# Altium schematic sheet ys18-3 for yi.schdoc
size 571 x 444 mm; Symbol: Sheet-Symbol_C; Device: Sheet-Symbol_C; @Page Name: P1; @Create Date: 2022-10-18; @Page Count: 1; @Page No: 1; @Project Name: ys18-3 for yi; @Schematic Name: Schematic1; @Update Date: 2022-10-27; Company: 嘉立创EDA; Page Size: C; Version: V1.0
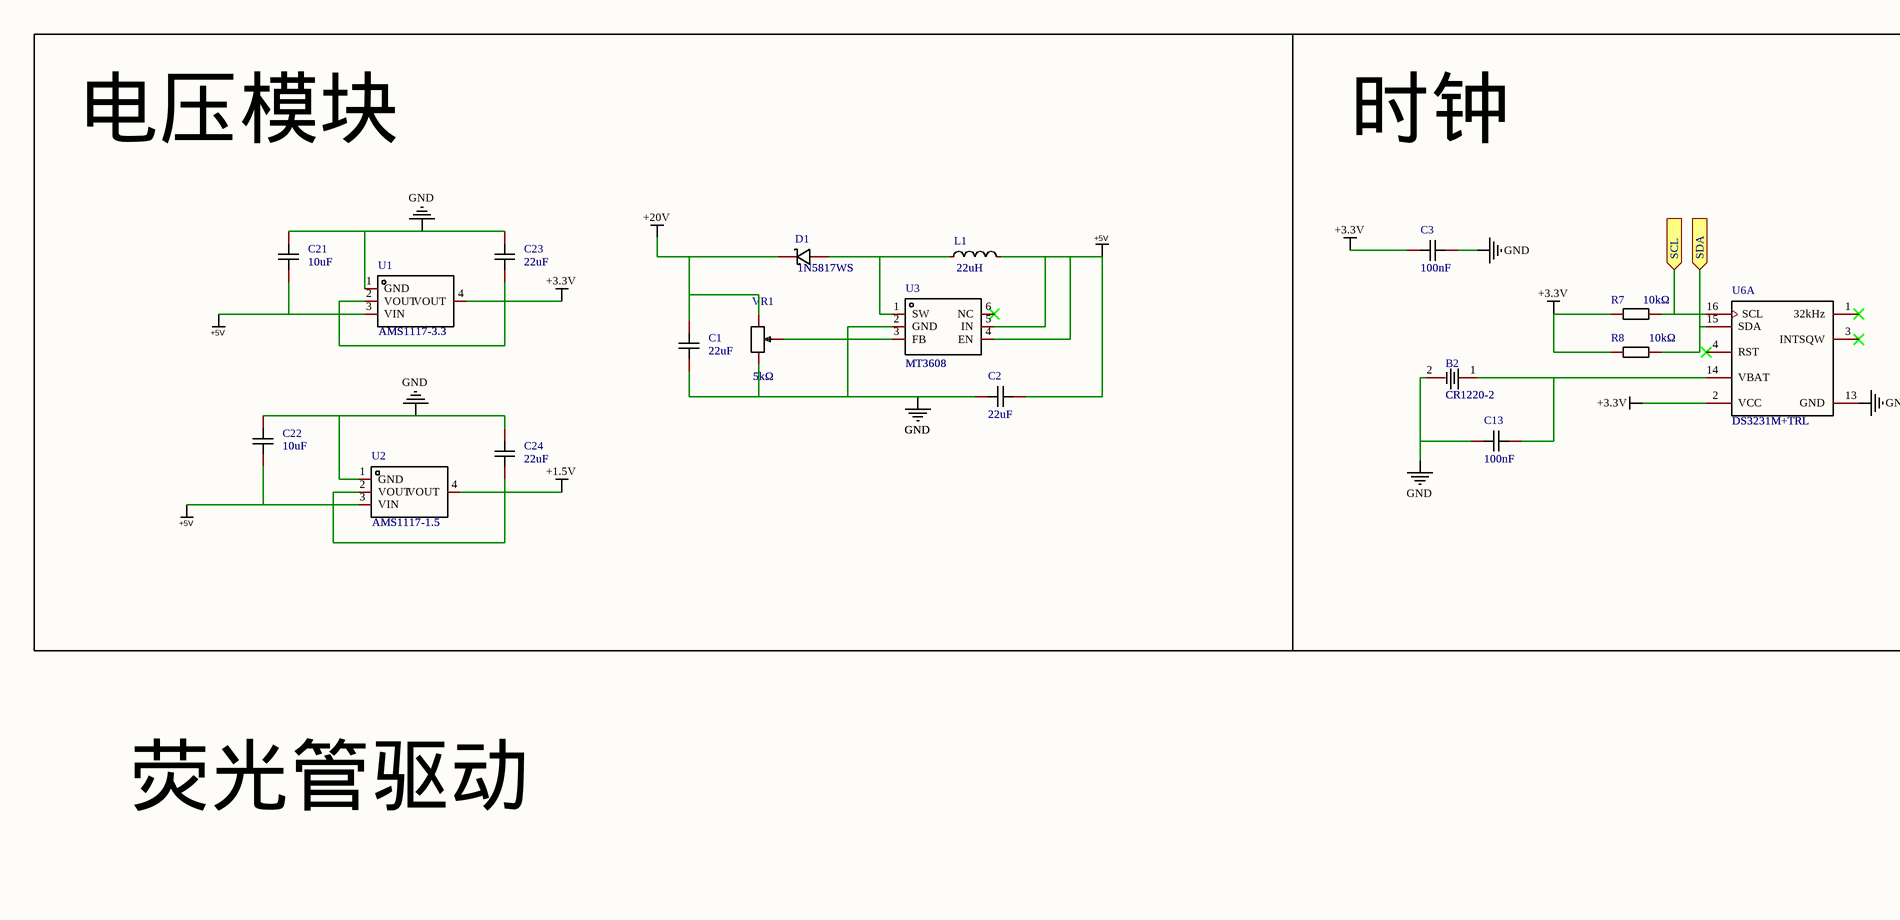
[diagram p0: ys18-3 for yi.schdoc, top left]
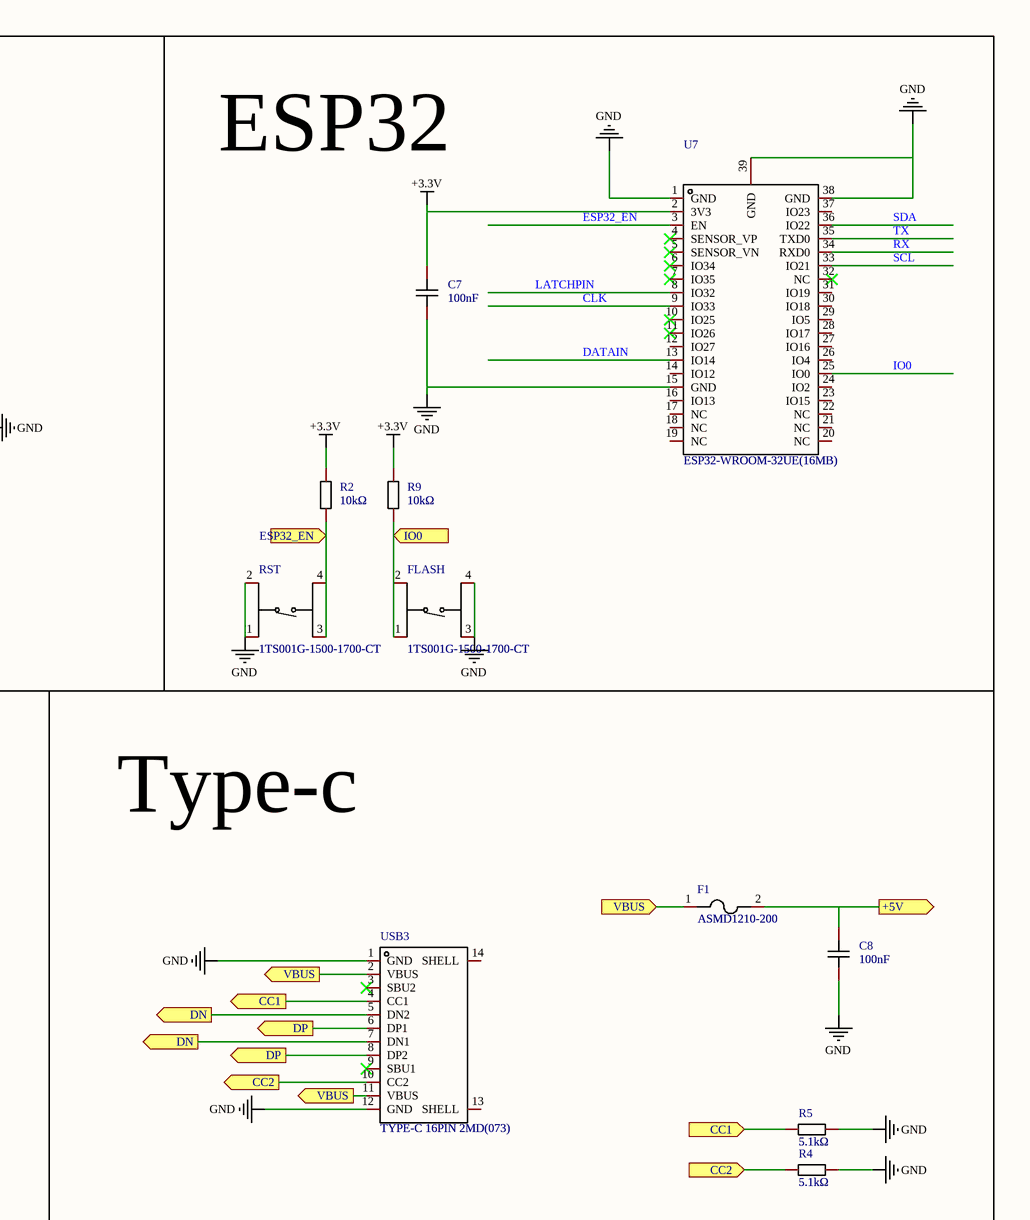
[diagram p1: ys18-3 for yi.schdoc, top right]
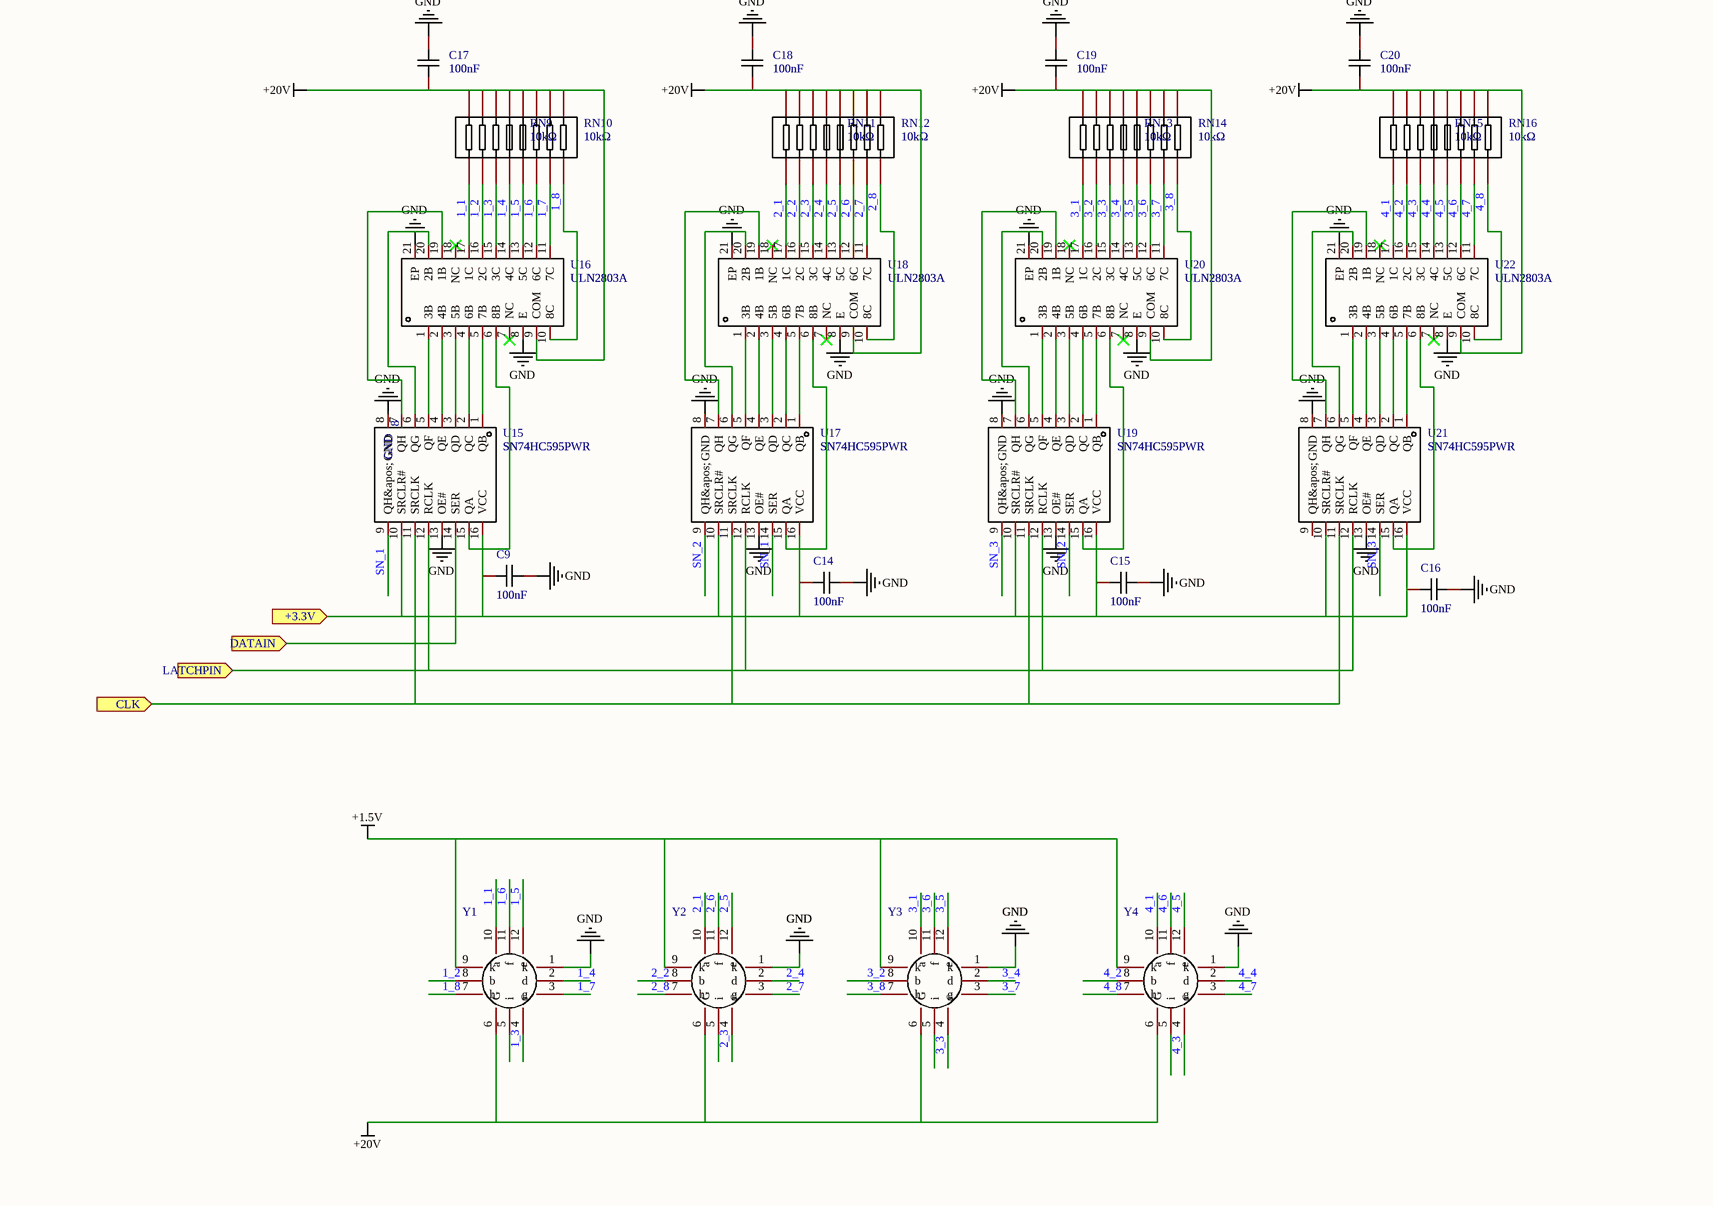
[diagram p2: ys18-3 for yi.schdoc, bottom left]
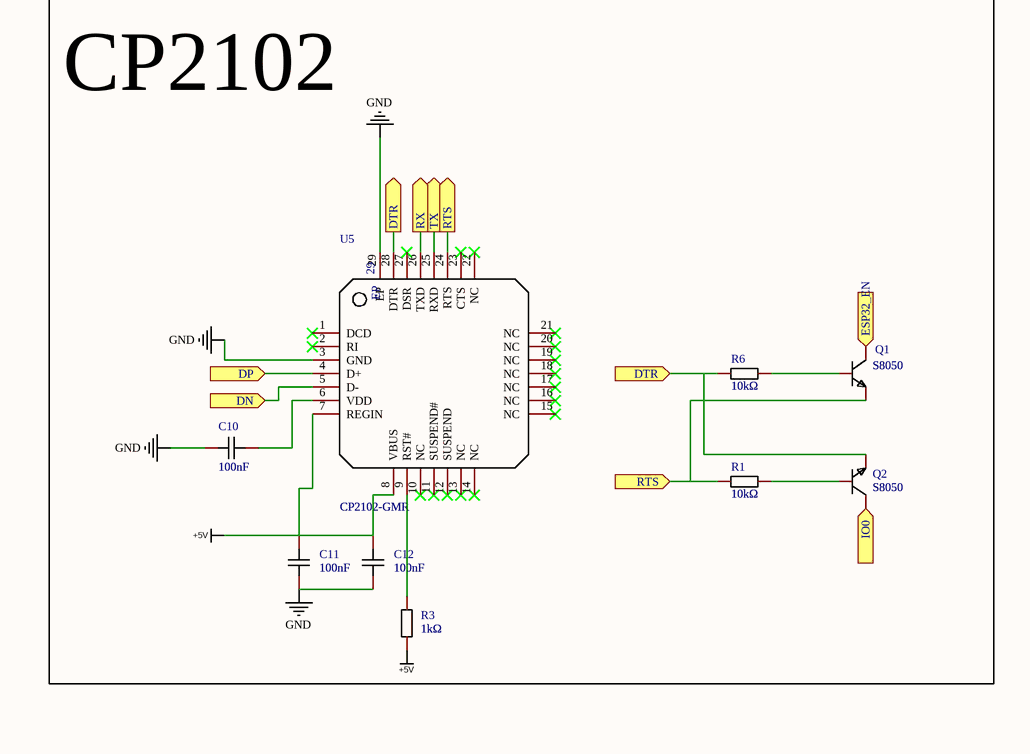
[diagram p3: ys18-3 for yi.schdoc, bottom right]

## Parts
B2  CR1220-2  [BAT-SMD_CR1220-2]
C1  22uF  [C0603]
C2  22uF  [C0603]
C3  100nF  [C0603]
C7  100nF  [C0603]
C8  100nF  [C0603]
C9  100nF  [C0603]
C10  100nF  [C0603]
C11  100nF  [C0603]
C12  100nF  [C0603]
C13  100nF  [C0603]
C14  100nF  [C0603]
C15  100nF  [C0603]
C16  100nF  [C0603]
C17  100nF  [C0603]
C18  100nF  [C0603]
C19  100nF  [C0603]
C20  100nF  [C0603]
C21  10uF  [C0603]
C22  10uF  [C0603]
C23  22uF  [C0603]
C24  22uF  [C0603]
D1  1N5817WS  [SOD-323_L1.8-W1.3-LS2.5-RD]
F1  ASMD1210-200  [F1210]
FLASH  1TS001G-1500-1700-CT  [SW-SMD_4P-L5.1-W5.1-P3.70-LS6.5-TL-2]
L1  22uH  [L1206]
Q1  S8050  [SOT-23_L2.9-W1.3-P1.90-LS2.4-BR]
Q2  S8050  [SOT-23_L2.9-W1.3-P1.90-LS2.4-BR]
R1  10kΩ  [R0603]
R2  10kΩ  [R0603]
R3  1kΩ  [R0603]
R4  5.1kΩ  [R0603]
R5  5.1kΩ  [R0603]
R6  10kΩ  [R0603]
R7  10kΩ  [R0603]
R8  10kΩ  [R0603]
R9  10kΩ  [R0603]
RN9  10kΩ  [RES-ARRAY-SMD_0603-8P-L3.2-W1.6-BL]
RN10  10kΩ  [RES-ARRAY-SMD_0603-8P-L3.2-W1.6-BL]
RN11  10kΩ  [RES-ARRAY-SMD_0603-8P-L3.2-W1.6-BL]
RN12  10kΩ  [RES-ARRAY-SMD_0603-8P-L3.2-W1.6-BL]
RN13  10kΩ  [RES-ARRAY-SMD_0603-8P-L3.2-W1.6-BL]
RN14  10kΩ  [RES-ARRAY-SMD_0603-8P-L3.2-W1.6-BL]
RN15  10kΩ  [RES-ARRAY-SMD_0603-8P-L3.2-W1.6-BL]
RN16  10kΩ  [RES-ARRAY-SMD_0603-8P-L3.2-W1.6-BL]
RST  1TS001G-1500-1700-CT  [SW-SMD_4P-L5.1-W5.1-P3.70-LS6.5-TL-2]
U1  AMS1117-3.3  [SOT-223-3_L6.7-W3.7-P2.30-LS7.0-BR]
U2  AMS1117-1.5  [SOT-223_L6.3-W3.5-P2.30-LS7.0-BR]
U3  MT3608  [SOT-23-6_L2.9-W1.6-P0.95-LS2.8-BR]
U5  CP2102-GMR  NAME: EP  NUMBER: 29  [WQFN-28_L5.0-W5.0-P0.50-BL-EP3.2]
U6  DS3231M+TRL  [SOIC-16_L10.3-W7.5-P1.27-LS10.3-BL]  (part A of 2)
U7  ESP32-WROOM-32UE(16MB)  [WIFI-SMD_ESP32-WROOM-32UE]
U15  SN74HC595PWR  NAME: GND  NUMBER: 8  [TSSOP-16_L5.0-W4.4-P0.65-LS6.4-BL]
U16  ULN2803A  [QFN-20_L4.0-W4.0-P0.50-BL-EP]
U17  SN74HC595PWR  [TSSOP-16_L5.0-W4.4-P0.65-LS6.4-BL]
U18  ULN2803A  [QFN-20_L4.0-W4.0-P0.50-BL-EP]
U19  SN74HC595PWR  [TSSOP-16_L5.0-W4.4-P0.65-LS6.4-BL]
U20  ULN2803A  [QFN-20_L4.0-W4.0-P0.50-BL-EP]
U21  SN74HC595PWR  [TSSOP-16_L5.0-W4.4-P0.65-LS6.4-BL]
U22  ULN2803A  [QFN-20_L4.0-W4.0-P0.50-BL-EP]
USB3  TYPE-C 16PIN 2MD(073)  [USB-C-SMD_TYPE-C-6PIN-2MD-073]
VR1  5kΩ  [RES-ADJ-SMD_3224W]
Y1  ys18-3  (value not drawn)
Y2  ys18-3  (value not drawn)
Y3  ys18-3  (value not drawn)
Y4  ys18-3  (value not drawn)

## Blocks framed on the sheet
电压模块: C1 C2 C21-C24 D1 L1 U1-U3 VR1
时钟: B2 C3 C13 R7 R8 U6
ESP32: C7 FLASH R2 R9 RST U7

## Ports
+3.3V (in), +5V (out), CC1 (in), CC1 (out), CC2 (in), CC2 (out), CLK (in), DATAIN (in), DN (in), DN (out), DP (in), DP (out), DTR (in), DTR (out), ESP32_EN (in), IO0 (in), LATCHPIN (in), RTS (in), RTS (out), RX (out), SCL (in), SDA (in), TX (out), VBUS (in), VBUS (out)

## Nets
+1.5V: C24.1 U2.2(VOUT) U2.4(VOUT) Y1.9(k) Y2.9(k) Y3.9(k) Y4.9(k)
+3.3V: C3.1 C7.1 C23.1 R2.1 R7.2 R8.1 R9.1 U1.2(VOUT) U1.4(VOUT) U6.2(VCC) U7.2(3V3)
+5V: C2.1 C11.1 C12.1 C21.1 C22.1 L1.2 R3.1 U1.3(VIN) U2.3(VIN) U3.4(EN) U3.5(IN) U5.7(REGIN) U5.8(VBUS)
+20V: C1.2 C17.1 C18.1 C19.1 C20.1 D1.1 RN9.5 RN9.6 RN9.7 RN9.8 RN10.5 RN10.6 RN10.7 RN10.8 RN11.5 RN11.6 RN11.7 RN11.8 RN12.5 RN12.6 RN12.7 RN12.8 RN13.5 RN13.6 RN13.7 RN13.8 RN14.5 RN14.6 RN14.7 RN14.8 RN15.5 RN15.6 RN15.7 RN15.8 RN16.5 RN16.6 RN16.7 RN16.8 U16.9(COM) U18.9(COM) U20.9(COM) U22.9(COM) VR1.3 Y1.6(G) Y2.6(G) Y3.6(G) Y4.6(G)
GND: B2.2 C1.1 C2.2 C3.2 C7.2 C8.2 C9.2 C10.1 C11.2 C12.2 C13.1 C14.2 C15.2 C16.2 C17.2 C18.2 C19.2 C20.2 C21.2 C22.2 C23.2 C24.2 FLASH.3(C) FLASH.4(D) R4.2 R5.2 RST.1(A) RST.2(B) U1.1(GND) U2.1(GND) U3.2(GND) U5.3(GND) U5.29(EP) U6.13(GND) U7.1(GND) U7.15(GND) U7.38(GND) U7.39(GND) U15.8(GND) U15.13(OE#) U16.8(E) U16.21(EP) U17.8(GND) U17.13(OE#) U18.8(E) U18.21(EP) U19.8(GND) U19.13(OE#) U20.8(E) U20.21(EP) U21.8(GND) U21.13(OE#) U22.8(E) U22.21(EP) USB3.1(GND) USB3.12(GND) VR1.1 Y1.1(k) Y2.1(k) Y3.1(k) Y4.1(k)
1_1: RN9.1 U16.17(1C) Y1.10(a)
1_2: RN9.2 U16.16(2C) Y1.8(b)
1_3: RN9.3 U16.15(3C) Y1.4(c)
1_4: RN9.4 U16.14(4C) Y1.2(d)
1_5: RN10.1 U16.13(5C) Y1.12(e)
1_6: RN10.2 U16.12(6C) Y1.11(f)
1_7: RN10.3 U16.11(7C) Y1.3(g)
1_8: RN10.4 U16.10(8C) Y1.7(h)
2_1: RN11.1 U18.17(1C) Y2.10(a)
2_2: RN11.2 U18.16(2C) Y2.8(b)
2_3: RN11.3 U18.15(3C) Y2.4(c)
2_4: RN11.4 U18.14(4C) Y2.2(d)
2_5: RN12.1 U18.13(5C) Y2.12(e)
2_6: RN12.2 U18.12(6C) Y2.11(f)
2_7: RN12.3 U18.11(7C) Y2.3(g)
2_8: RN12.4 U18.10(8C) Y2.7(h)
3_1: RN13.1 U20.17(1C) Y3.10(a)
3_2: RN13.2 U20.16(2C) Y3.8(b)
3_3: RN13.3 U20.15(3C) Y3.4(c)
3_4: RN13.4 U20.14(4C) Y3.2(d)
3_5: RN14.1 U20.13(5C) Y3.12(e)
3_6: RN14.2 U20.12(6C) Y3.11(f)
3_7: RN14.3 U20.11(7C) Y3.3(g)
3_8: RN14.4 U20.10(8C) Y3.7(h)
4_1: RN15.1 U22.17(1C) Y4.10(a)
4_2: RN15.2 U22.16(2C) Y4.8(b)
4_3: RN15.3 U22.15(3C) Y4.4(c)
4_4: RN15.4 U22.14(4C) Y4.2(d)
4_5: RN16.1 U22.13(5C) Y4.12(e)
4_6: RN16.2 U22.12(6C) Y4.11(f)
4_7: RN16.3 U22.11(7C) Y4.3(g)
4_8: RN16.4 U22.10(8C) Y4.7(h)
+3.3V: C9.1 C14.1 C15.1 C16.1 U15.10(SRCLR#) U15.16(VCC) U17.10(SRCLR#) U17.16(VCC) U19.10(SRCLR#) U19.16(VCC) U21.10(SRCLR#) U21.16(VCC) ; port +3.3V  [a separate net that carries the same name]
+5V: C8.1 F1.2 ; port +5V  [a separate net that carries the same name]
CC1: R5.1 USB3.4(CC1) ; port CC1
CC2: R4.1 USB3.10(CC2) ; port CC2
CLK: U7.9(IO33)
CLK: U15.11(SRCLK) U17.11(SRCLK) U19.11(SRCLK) U21.11(SRCLK) ; port CLK  [a separate net that carries the same name]
DATAIN: U7.13(IO14)
DATAIN: U15.14(SER) ; port DATAIN  [a separate net that carries the same name]
DN: U5.5(D-) USB3.5(DN2) USB3.7(DN1) ; port DN
DP: U5.4(D+) USB3.6(DP1) USB3.8(DP2) ; port DP
DTR: Q2.2(E) R6.2 U5.28(DTR) ; port DTR
ESP32_EN: Q1.3(C) R2.2 RST.3(C) RST.4(D) ; port ESP32_EN
ESP32_EN: U7.3(EN)  [a separate net that carries the same name]
IO0: FLASH.1(A) FLASH.2(B) Q2.3(C) R9.2 ; port IO0
IO0: U7.25(IO0)  [a separate net that carries the same name]
LATCHPIN: U7.8(IO32)
LATCHPIN: U15.12(RCLK) U17.12(RCLK) U19.12(RCLK) U21.12(RCLK) ; port LATCHPIN  [a separate net that carries the same name]
RTS: Q1.2(E) R1.2 U5.24(RTS) ; port RTS
RX: U5.26(TXD) ; port RX
RX: U7.34(RXD0)  [a separate net that carries the same name]
SCL: R7.1 U6.16(SCL) ; port SCL
SCL: U7.33(IO21)  [a separate net that carries the same name]
SDA: R8.2 U6.15(SDA) ; port SDA
SDA: U7.36(IO22)  [a separate net that carries the same name]
SN_1: U15.9(QH&apos;) U17.14(SER)
SN_2: U17.9(QH&apos;) U19.14(SER)
SN_3: U19.9(QH&apos;) U21.14(SER)
TX: U5.25(RXD) ; port TX
TX: U7.35(TXD0)  [a separate net that carries the same name]
VBUS: F1.1 USB3.2(VBUS) USB3.11(VBUS) ; port VBUS
NetB2_1: B2.1 C13.2 U6.14(VBAT)
NetC10_2: C10.2 U5.6(VDD)
NetD1_2: D1.2 L1.1 U3.1(SW)
NetQ1_1: Q1.1(B) R6.1
NetQ2_1: Q2.1(B) R1.1
NetR3_2: R3.2 U5.9(RST#)
NetU3_3: U3.3(FB) VR1.2
NetU15_1: U15.1(QB) U16.5(7B)
NetU15_2: U15.2(QC) U16.4(6B)
NetU15_3: U15.3(QD) U16.3(5B)
NetU15_4: U15.4(QE) U16.2(4B)
NetU15_5: U15.5(QF) U16.1(3B)
NetU15_6: U15.6(QG) U16.20(2B)
NetU15_7: U15.7(QH) U16.19(1B)
NetU15_15: U15.15(QA) U16.6(8B)
NetU17_1: U17.1(QB) U18.5(7B)
NetU17_2: U17.2(QC) U18.4(6B)
NetU17_3: U17.3(QD) U18.3(5B)
NetU17_4: U17.4(QE) U18.2(4B)
NetU17_5: U17.5(QF) U18.1(3B)
NetU17_6: U17.6(QG) U18.20(2B)
NetU17_7: U17.7(QH) U18.19(1B)
NetU17_15: U17.15(QA) U18.6(8B)
NetU19_1: U19.1(QB) U20.5(7B)
NetU19_2: U19.2(QC) U20.4(6B)
NetU19_3: U19.3(QD) U20.3(5B)
NetU19_4: U19.4(QE) U20.2(4B)
NetU19_5: U19.5(QF) U20.1(3B)
NetU19_6: U19.6(QG) U20.20(2B)
NetU19_7: U19.7(QH) U20.19(1B)
NetU19_15: U19.15(QA) U20.6(8B)
NetU21_1: U21.1(QB) U22.5(7B)
NetU21_2: U21.2(QC) U22.4(6B)
NetU21_3: U21.3(QD) U22.3(5B)
NetU21_4: U21.4(QE) U22.2(4B)
NetU21_5: U21.5(QF) U22.1(3B)
NetU21_6: U21.6(QG) U22.20(2B)
NetU21_7: U21.7(QH) U22.19(1B)
NetU21_15: U21.15(QA) U22.6(8B)

Not connected (* = marked no-connect by the designer): U3 6(NC)*; U5 1(DCD)* 2(RI)* 10(NC)* 11(SUSPEND#)* 12(SUSPEND)* 13(NC)* 14(NC)* 15(NC)* 16(NC)* 17(NC)* 18(NC)* 19(NC)* 20(NC)* 21(NC)* 22(NC)* 23(CTS)* 27(DSR)*; U6 1(32kHz)* 3(INTSQW)* 4(RST)*; U7 4(SENSOR_VP)* 5(SENSOR_VN)* 6(IO34)* 7(IO35)* 10(IO25)* 11(IO26)* 12(IO27) 14(IO12) 16(IO13) 17(NC) 18(NC) 19(NC) 20(NC) 21(NC) 22(NC) 23(IO15) 24(IO2) 26(IO4) 27(IO16) 28(IO17) 29(IO5) 30(IO18) 31(IO19) 32(NC)* 37(IO23); U16 7(NC)* 18(NC)*; U18 7(NC)* 18(NC)*; U20 7(NC)* 18(NC)*; U21 9(QH&apos;); U22 7(NC)* 18(NC)*; USB3 3(SBU2)* 9(SBU1)* 13(SHELL) 14(SHELL); Y1 5(i); Y2 5(i); Y3 5(i); Y4 5(i)

## Notes on the sheet
- Type-c
- 荧光管驱动
- CP2102
- 1
- 2
- 3
- 4
- 5
- 6
- A
- B
- C
- D
- Schematic
- Schematic1
- Create Date
- Update Date
- 2022-10-18
- 2022-10-27
- Reviewed
- Drawed
- Page
- P1
- Part Number
- ys18-3 for yi
- VER
- SIZE
- PAGE
- OF
- V1.0
- 嘉立创EDA

## Library data of the parts
B2 = CR1220-2: 连接器类型:电池底座;适用电池规格:CR1220;工作温度范围:-;; Manufacturer: Q&J; Add into BOM: yes; Connector Type: 电池底座; Battery Type: CR1220; Name: CR1220-2; Symbol: CR1220-2; Device: CR1220-2; LCSC Part Name: 电池底座 适用电池:CR1220; Supplier Part: C70381; Manufacturer Part: CR1220-2; Supplier Footprint: SMD; JLCPCB Part Class: Extended Part; Datasheet: https://atta.szlcsc.com/upload/public/pdf/source/20160427/1461725216696.pdf; Supplier: LCSC; Convert to PCB: yes; Operating Temperature Range: -
C1 C2 C23 C24 = CL10A226MP8NUNE: 温度系数:X5R;精度:±20%;额定电压:10V;容值:22uF;; Manufacturer: SAMSUNG(三星); Add into BOM: yes; Temperature Coefficient: X5R; Tolerance: ±20%; Voltage Rated: 10V; Name: 22uF; Symbol: CL10A226MP8NUNE; Device: CL10A226MP8NUNE; LCSC Part Name: 22uF(226) ±20% 10V; Supplier Part: C86295; Manufacturer Part: CL10A226MP8NUNE; Supplier Footprint: 0603; JLCPCB Part Class: Extended Part; Datasheet: https://atta.szlcsc.com/upload/public/pdf/source/20170325/1490427882169.pdf; Supplier: LCSC; Convert to PCB: yes; Value: 22uF
C3 C7 C9 C13-C20 = CC0603KRX7R9BB104: 容值:100nF;精度:±10%;额定电压:50V;材质(温度系数):X7R;; Manufacturer: YAGEO(国巨); Add into BOM: yes; Tolerance: ±10%; Voltage Rated: 50V; Temperature Coefficient: X7R; Name: 100nF; Symbol: CC0603KRX7R9BB104; Device: CC0603KRX7R9BB104; LCSC Part Name: 100nF ±10% 50V; Supplier Part: C14663; Manufacturer Part: CC0603KRX7R9BB104; Supplier Footprint: 0603; JLCPCB Part Class: Basic Part; Datasheet: https://atta.szlcsc.com/upload/public/pdf/source/20170116/1484561234239.pdf; Supplier: LCSC; Convert to PCB: yes; Value: 100nF
C8 C10-C12 = CL10B104KB8NNNC: 容值:100nF;精度:±10%;额定电压:50V;材质(温度系数):X7R;; Manufacturer: SAMSUNG(三星); Add into BOM: yes; Tolerance: ±10%; Voltage Rated: 50V; Temperature Coefficient: X7R; Name: 100nF; Symbol: CL10B104KB8NNNC; Device: CL10B104KB8NNNC; LCSC Part Name: 100nF ±10% 50V; Supplier Part: C1591; Manufacturer Part: CL10B104KB8NNNC; Supplier Footprint: 0603; JLCPCB Part Class: Extended Part; Datasheet: https://atta.szlcsc.com/upload/public/pdf/source/20160103/1457707680512.pdf; Supplier: LCSC; Convert to PCB: yes; Value: 100nF
C21 C22 = CL10A106KP8NNNC: 容值:10uF;精度:±10%;额定电压:10V;材质(温度系数):X5R;; Manufacturer: SAMSUNG(三星); Add into BOM: yes; Tolerance: ±10%; Voltage Rated: 10V; Temperature Coefficient: X5R; Name: 10uF; Symbol: CL10A106KP8NNNC; Device: CL10A106KP8NNNC; LCSC Part Name: 10uF ±10% 10V; Supplier Part: C19702; Manufacturer Part: CL10A106KP8NNNC; Supplier Footprint: 0603; JLCPCB Part Class: Basic Part; Datasheet: https://atta.szlcsc.com/upload/public/pdf/source/20160103/1457707703378.pdf; Supplier: LCSC; Convert to PCB: yes; Value: 10uF
D1 = 1N5817WS: 直流反向耐压(Vr):20V;平均整流电流(Io):1A;正向压降(Vf):750mV@3.1A;; Manufacturer: KEXIN(科信); Add into BOM: yes; Reverse Voltage (Vr): 20V; Average Rectified Current (Io): 1A; Name: 1N5817WS; Symbol: 1N5817WS; Device: 1N5817WS; LCSC Part Name: 20V 1A 750mV@3.1A; Supplier Part: C489146; Manufacturer Part: 1N5817WS; Supplier Footprint: SOD-323; JLCPCB Part Class: Extended Part; Datasheet: https://atta.szlcsc.com/upload/public/pdf/source/20200225/C489146_1AEA3DEFB6CB7B45A04303A9837E7FE9.pdf; Supplier: LCSC; Convert to PCB: yes; Forward Voltage (Vf@If): 750mV@3.1A
F1 = ASMD1210-200: 最大电压:6V;最大电流:100A;保持电流:2A;跳闸电流:4A;消耗功率:800mW;初始态阻值(最小值):15mΩ;跳断后阻值(最大值):70mΩ;最大动作时间:1s;工作温度:-40~+85;; Manufacturer: JDTfuse(集电通); Add into BOM: yes; Operating Voltage (Max): 6V; Current Rating (Max): 100A; Hold Current: 2A; Trip Current: 4A; Power Dissipation: 800mW; Resistance - Initial (Ri) (Min): 15mΩ; Resistance - Post Trip (R1) (Max): 70mΩ; Maximum Time to Trip: 1s; Name: ASMD1210-200; Symbol: ASMD1210-200; Device: ASMD1210-200; LCSC Part Name: 2A 自恢复; Supplier Part: C135353; Manufacturer Part: ASMD1210-200; Supplier Footprint: 1210; JLCPCB Part Class: Extended Part; Datasheet: https://atta.szlcsc.com/upload/public/pdf/source/20220401/E691521C3F91CC1DEA097B44A52FED26.pdf; Supplier: LCSC; Convert to PCB: yes; Operating Temperature: -40~+85
FLASH RST = 1TS001G-1500-1700-CT: 触点电流:20mA;额定电压(DC):12V;电路结构:单刀单掷;安装方式:立贴;按钮形状:圆形按钮;带灯:-;开关长度:5.1mm;开关宽度:5.1mm;开关高度:0.5mm;; Manufacturer: HYP(鸿源精密); Add into BOM: yes; Contact Current: 20mA; Voltage Rating (DC): 12V; Circuit: 单刀单掷; Actuator Style: 圆形按钮; Switch Length: 5.1mm; Switch Height: 0.5mm; Name: 1TS001G-1500-1700-CT; Symbol: 1TS001G-1500-1700; Device: 1TS001G-1500-1700-CT; LCSC Part Name: 铜头按钮; Supplier Part: C318801; Manufacturer Part: 1TS001G-1500-1700-CT; Supplier Footprint: SMD,5.1x5.1mm; JLCPCB Part Class: Extended Part; Datasheet: https://atta.szlcsc.com/upload/public/pdf/source/20200109/C318801_99D5DB96CF1592C478CEC78FA29D92FA.pdf; Supplier: LCSC; Convert to PCB: yes; Mounting Style: 立贴; With Lamp: -; Switch Width: 5.1mm
L1 = CMP321609JE220MT: 电感值:22uH;精度:±20%;额定电流:50mA;饱和电流(Isat):-;直流电阻(DCR):1Ω;; Manufacturer: FH(风华); Add into BOM: yes; Tolerance: ±20%; Rated Current: 50mA; DC Resistance (DCR): 1Ω; Frequency - Self Resonant: 16MHz; Name: 22uH; Symbol: CMP321609JE220MT; Device: CMP321609JE220MT; LCSC Part Name: 22uH ±20% 50mA 1Ω; Supplier Part: C395020; Manufacturer Part: CMP321609JE220MT; Supplier Footprint: 1206; JLCPCB Part Class: Extended Part; Datasheet: https://atta.szlcsc.com/upload/public/pdf/source/20190710/C395020_13B0BAAF995C388AF2EAC40278D9911F.pdf; Supplier: LCSC; Convert to PCB: yes; Value: 22uH; Saturation Current (Isat): -; Q @ Freq: -; Ratings: -
Q1 Q2 = S8050: 晶体管类型:NPN;集射极击穿电压(Vceo):25V;集电极电流(Ic):500mA;功率(Pd):625mW;集电极-发射极饱和电压(VCE(sat)@Ic,Ib):600mV@500mA,50mA;直流电流增益(hFE@Ic,Vce):200@100mA,1V;特征频率(fT):150MHz;工作温度:+150@(Tj);; Manufacturer: GP(格瑞宝); Symbol: S8050_C414195; Add into BOM: yes; Transistor Type: NPN; Collector-Emitter Breakdown Voltage (Vceo): 25V; Collector Current (Ic): 500mA; Power Dissipation (Pd): 625mW; Transition Frequency (fT): 150MHz; Name: S8050; Device: S8050; LCSC Part Name: NPN 25V 500mA; Supplier Part: C414195; Manufacturer Part: S8050; Supplier Footprint: SOT-23; JLCPCB Part Class: Extended Part; Datasheet: https://atta.szlcsc.com/upload/public/pdf/source/20190828/C414195_F420B1E456405127F3181AB0586AEC6F.pdf; Supplier: LCSC; Convert to PCB: yes; Collector-Emitter Saturation Voltage (VCE(sat)@Ic,Ib): 600mV@500mA,50mA; DC Current Gain (hFE@Ic,Vce): 200@100mA,1V; Operating Temperature: +150@(Tj)
R1 R2 R6-R9 = 0603WAF1002T5E: 电阻类型:厚膜电阻;阻值:10kΩ;精度:±1%;功率:100mW;温度系数:±100ppm/;最大工作电压:75V;工作温度范围:-55~+155;; Manufacturer: UNI-ROYAL(厚声); Add into BOM: yes; Tolerance: ±1%; Power(Watts): 100mW; Overload Voltage (Max): 75V; Name: 10kΩ; Symbol: 0603WAF1002T5E; Device: 0603WAF1002T5E; LCSC Part Name: 10kΩ ±1% 100mW; Supplier Part: C25804; Manufacturer Part: 0603WAF1002T5E; Supplier Footprint: 0603; JLCPCB Part Class: Basic Part; Datasheet: https://atta.szlcsc.com/upload/public/pdf/source/20200306/C422600_1E6D84923E4A46A82E41ADD87F860B5C.pdf; Supplier: LCSC; Convert to PCB: yes; Type: 厚膜电阻; Value: 10kΩ; Temperature Coefficient: ±100ppm/; Operating Temperature Range: -55~+155
R3 = RC0603FR-071KL: 电阻类型:厚膜电阻;阻值:1kΩ;精度:±1%;功率:100mW;温度系数:±100ppm/;最大工作电压:75V;工作温度范围:-55~+155;; Manufacturer: YAGEO(国巨); Add into BOM: yes; Tolerance: ±1%; Power(Watts): 100mW; Overload Voltage (Max): 75V; Name: 1kΩ; Symbol: RC0603FR-071KL; Device: RC0603FR-071KL; LCSC Part Name: 1kΩ ±1% 100mW; Supplier Part: C22548; Manufacturer Part: RC0603FR-071KL; Supplier Footprint: 0603; JLCPCB Part Class: Extended Part; Datasheet: https://atta.szlcsc.com/upload/public/pdf/source/20180312/7BD3618A8B6324EA6280B0497A051AB7.pdf; Supplier: LCSC; Convert to PCB: yes; Type: 厚膜电阻; Value: 1kΩ; Temperature Coefficient: ±100ppm/; Operating Temperature Range: -55~+155
R4 R5 = 0603WAF5101T5E: 电阻类型:厚膜电阻;阻值:5.1kΩ;精度:±1%;功率:100mW;温度系数:±100ppm/;最大工作电压:75V;工作温度范围:-55~+155;; Manufacturer: UNI-ROYAL(厚声); Add into BOM: yes; Tolerance: ±1%; Power(Watts): 100mW; Overload Voltage (Max): 75V; Name: 5.1kΩ; Symbol: 0603WAF5101T5E; Device: 0603WAF5101T5E; LCSC Part Name: 5.1kΩ ±1% 100mW; Supplier Part: C23186; Manufacturer Part: 0603WAF5101T5E; Supplier Footprint: 0603; JLCPCB Part Class: Basic Part; Datasheet: https://atta.szlcsc.com/upload/public/pdf/source/20200306/C422600_1E6D84923E4A46A82E41ADD87F860B5C.pdf; Supplier: LCSC; Convert to PCB: yes; Type: 厚膜电阻; Value: 5.1kΩ; Temperature Coefficient: ±100ppm/; Operating Temperature Range: -55~+155
RN9-RN16 = 4D03WGJ0103T5E: 阻值:10kΩ;单个元件功率:62.5mW;电阻器数:4;引脚数:8;; Manufacturer: UNI-ROYAL(厚声); Add into BOM: yes; Power(Watts): 62.5mW; Number of Resistors: 4; Name: 10kΩ; Symbol: 4D03WGJ0103T5E; Device: 4D03WGJ0103T5E; LCSC Part Name: 10kΩ ±5%; Supplier Part: C29718; Manufacturer Part: 4D03WGJ0103T5E; Supplier Footprint: 0603x4; JLCPCB Part Class: Basic Part; Datasheet: https://atta.szlcsc.com/upload/public/pdf/source/20170615/1497511005633.pdf; Supplier: LCSC; Convert to PCB: yes; Value: 10kΩ; Number of Pins: 8
U1 = AMS1117-3.3_C917183: 输出类型:-;; Manufacturer: JSMSEMI(杰盛微); Add into BOM: yes; Name: AMS1117-3.3; Symbol: AMS1117-3.3_C917183; Device: AMS1117-3.3_C917183; LCSC Part Name: 正 Vin=30V Vout=3.3V 1A; Supplier Part: C917183; Manufacturer Part: AMS1117-3.3; Supplier Footprint: SOT-223; JLCPCB Part Class: Extended Part; Datasheet: https://atta.szlcsc.com/upload/public/pdf/source/20211201/578FEEF9766904D398893791CE3EC879.pdf; Supplier: LCSC; Convert to PCB: yes; Output Type: -
U2 = AMS1117-1.5: 输出类型:-;; Manufacturer: JSMSEMI(杰盛微); Symbol: AMS1117-1.5_C963403; Add into BOM: yes; Name: AMS1117-1.5; Device: AMS1117-1.5; LCSC Part Name: AMS1117-1.5; Supplier Part: C963403; Manufacturer Part: AMS1117-1.5; Supplier Footprint: SOT-223; JLCPCB Part Class: Extended Part; Datasheet: https://atta.szlcsc.com/upload/public/pdf/source/20211201/578FEEF9766904D398893791CE3EC879.pdf; Supplier: LCSC; Convert to PCB: yes; Output Type: -
U3 = MT3608: 功能类型:升压型;同步整流:-;输出通道数:1;拓扑结构:升压式;输入电压:2V~24V;输出电压:28V;输出电流(最大值):-;开关频率:1.2MHz;; Manufacturer: 西安航天民芯; Add into BOM: yes; Function: 升压型; Number of Outputs: 1; Topology: 升压式; Input Voltage: 2V~24V; Output Voltage: 28V; Switching Frequency: 1.2MHz; Name: MT3608; Symbol: MT3608; Device: MT3608; LCSC Part Name: 升压型 2V~24V 1.2MHz; Supplier Part: C84817; Manufacturer Part: MT3608; Supplier Footprint: SOT-23-6; JLCPCB Part Class: Extended Part; Datasheet: https://atta.szlcsc.com/upload/public/pdf/source/20161110/1478743351706.pdf; Supplier: LCSC; Convert to PCB: yes; Synchronous Rectification: -; Output Current (Max): -
U5 = CP2102-GMR: 类型:Transceiver;协议类别:USB;驱动器/接收器数:1/1;数据速率:1Mbps;; Manufacturer: SILICON LABS(芯科); Add into BOM: yes; Protocol: USB; Number of Drivers/Receivers: 1/1; Data Rate: 1Mbps; Supply Voltage: 3V ~ 3.6V; Name: CP2102-GMR; Symbol: CP2102-GMR; Device: CP2102-GMR; LCSC Part Name: CP2102-GMR; Supplier Part: C6568; Manufacturer Part: CP2102-GMR; Supplier Footprint: QFN-28_5x5x05P; JLCPCB Part Class: Basic Part; Datasheet: https://atta.szlcsc.com/upload/public/pdf/source/20170103/1483439882795.pdf; Supplier: LCSC; Convert to PCB: yes; Type: Transceiver
U6 = DS3231M+TRL: 时钟芯片类型:Clock/Calendar;存储器容量:-;时间格式:HH:MM:SS (12/24 hr);日期格式:YY-MM-DD-dd;接口类型:I2C, 2-Wire Serial;; Manufacturer: MAXIM(美信); Add into BOM: yes; Voltage - Supply: 2.3V ~ 5.5V; Current - Timekeeping (Max): 130A ~ 200A @ 3.63V ~ 5.5V; Name: DS3231M+TRL; Symbol: DS3231M+TRL; Device: DS3231M+TRL; LCSC Part Name: DS3231MRL; Supplier Part: C37663; Manufacturer Part: DS3231M+TRL; Supplier Footprint: SOIC-16_300mil; JLCPCB Part Class: Extended Part; Datasheet: https://atta.szlcsc.com/upload/public/pdf/source/20141025/1457707245139.pdf; Supplier: LCSC; Convert to PCB: yes; Type: Clock/Calendar; Features: Alarm, Leap Year, Square Wave Output; Memory Size: -; Time Format: HH:MM:SS (12/24 hr); Date Format: YY-MM-DD-dd; Interface: I2C, 2-Wire Serial; Voltage - Supply, Battery: 2.3V ~ 5.5V
U7 = ESP32-WROOM-32UE(16MB): ESP32-WROOM-32UE 集成 ESP32-D0WD-V3 芯片，具有?高的稳定性和安全性能。; Manufacturer: ESPRESSIF(乐鑫); Add into BOM: yes; Name: ESP32-WROOM-32UE(16MB); Symbol: ESP32-WROOM-32UE(16MB); Device: ESP32-WROOM-32UE(16MB); LCSC Part Name: WIFI模块 外接天线IPEX模组; Supplier Part: C701346; Manufacturer Part: ESP32-WROOM-32UE(16MB); Supplier Footprint: SDM38,18x19.2x3.2; JLCPCB Part Class: Extended Part; Datasheet: https://atta.szlcsc.com/upload/public/pdf/source/20200730/C701341_95E089979D39CD8D2471FDC7C7AF29A1.pdf; Supplier: LCSC; Convert to PCB: yes
U15 U17 U19 U21 = SN74HC595PWR: SN74HC595 具有三态输出寄存器的 8 位移位寄存器; Manufacturer: TI(德州仪器); Add into BOM: yes; Name: SN74HC595PWR; Symbol: SN74HC595PWR; Device: SN74HC595PWR; LCSC Part Name: SN74HC595PWR; Supplier Part: C273642; Manufacturer Part: SN74HC595PWR; Supplier Footprint: TSSOP-16; JLCPCB Part Class: Extended Part; Datasheet: https://atta.szlcsc.com/upload/public/pdf/source/20190621/C273642_92835B05F3A759EE9EC4EFE4F56C0791.pdf; Supplier: LCSC; Convert to PCB: yes
U16 U18 U20 U22 = ULN2803A_C493377: 开态输入电压(VI(on)@Vce,Ic):-;集电极电流(Ic):-;集射极饱和压降(VCE(sat)@Ii,Ic):-;输出漏电流(Icex@Vce):-;开态输入电流(Ii@Vi):-;关态输入电流(Ii(off)@Vce,Ic):-;嵌位二极管漏电流(IR@VR):-;嵌位二极管正向压降(VF@IF):-;输入电容(Ci):-;工作温度:-;; Manufacturer: Mixic(中科芯亿达); Add into BOM: yes; Name: ULN2803A; Symbol: ULN2803A_C493377; Device: ULN2803A_C493377; LCSC Part Name: ULN2803A; Supplier Part: C493377; Manufacturer Part: ULN2803A; Supplier Footprint: QFN-20; JLCPCB Part Class: Extended Part; Datasheet: https://atta.szlcsc.com/upload/public/pdf/source/20200417/C493377_96E7298976A1714D07CEFF283F4FBF93.pdf; Supplier: LCSC; Convert to PCB: yes; ON-state input   voltage(VI(on)@Vce,Ic): -; Collector Current(Ic): -; Collector-emitter   saturation voltage (VCE(sat)@Ii,Ic): -; Output leakage current (Icex@Vce): -; Input current (Ii@Vi): -; Off-state input current (Ii(off)@Vce,Ic): -; Clamp Diode Leakage Current (IR@VR): -; Clamp Diode Forward Voltage (VF@IF): -; Input Capacitance (Ci): -; Operating Temperature: -
USB3 = TYPE-C 16PIN 2MD(073): 连接器类型:Type-C;标准:-;公母:母座;触点数量:16;端口数量:1;安装方式:卧贴;额定电流 - 电源:5A;工作温度范围:-25~+85;; Manufacturer: SHOU HAN(首韩); Add into BOM: yes; Gender: 母座; Number of Contacts: 16; Number of Ports: 1; Current Rating - Power (Max): 5A; Name: TYPE-C 16PIN 2MD(073); Symbol: TYPE-C 16PIN 2MD(073); Device: TYPE-C 16PIN 2MD(073); LCSC Part Name: Type-C 母座 卧贴 带定位柱 不锈钢外壳 2次模顶; Supplier Part: C2765186; Manufacturer Part: TYPE-C 16PIN 2MD(073); Supplier Footprint: SMD; JLCPCB Part Class: Extended Part; Datasheet: https://atta.szlcsc.com/upload/public/pdf/source/20211123/39B17C16241EAC15C5E277BDA434118E.pdf; Supplier: LCSC; Convert to PCB: yes; Connector Type: Type-C; Standard: -; Mounting Style: 卧贴; Operating Temperature Range: -25~+85
VR1 = 3224W-1-502E: 阻值:5kΩ;精度:±10%;温度系数:±100ppm/;; Manufacturer: BOURNS; Add into BOM: yes; Tolerance: ±10%; Name: 5kΩ; Symbol: 3224W-1-502E; Device: 3224W-1-502E; LCSC Part Name: 5kΩ ±10%; Supplier Part: C81349; Manufacturer Part: 3224W-1-502E; Supplier Footprint: 3224W; JLCPCB Part Class: Extended Part; Datasheet: https://atta.szlcsc.com/upload/public/pdf/source/20160830/1472551532733.pdf; Supplier: LCSC; Convert to PCB: yes; Value: 5kΩ; Temperature Coefficient: ±100ppm/
Y1-Y4 = ys18-3: Add into BOM: yes; Symbol: ys18-3; Device: ys18-3; Convert to PCB: yes